# Altium schematic sheet Receiver.SchDoc
size A4; SheetNumber: 1; SheetTotal: 6
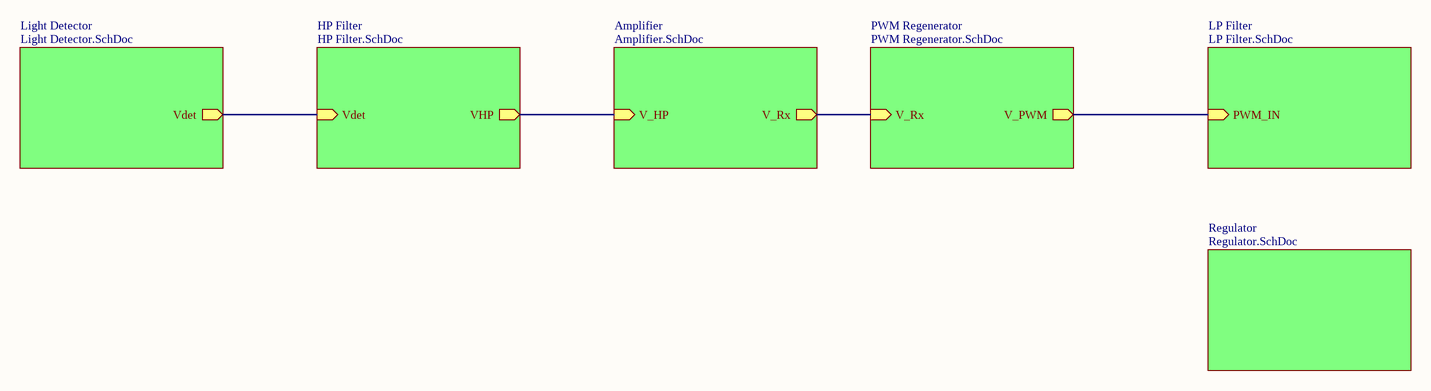
[diagram p0: Receiver.SchDoc]

## Sub-sheets
Amplifier = Amplifier.SchDoc: V_HP (in), V_Rx (out)
HP Filter = HP Filter.SchDoc: VHP (out), Vdet (in)
Light Detector = Light Detector.SchDoc: Vdet (out)
LP Filter = LP Filter.SchDoc: PWM_IN (in)
PWM Regenerator = PWM Regenerator.SchDoc: V_Rx (in), V_PWM (out)
Regulator = Regulator.SchDoc: no entries

## Nets
(unnamed): sheet Light Detector/Vdet, sheet HP Filter/Vdet
(unnamed): sheet HP Filter/VHP, sheet Amplifier/V_HP
(unnamed): sheet Amplifier/V_Rx, sheet PWM Regenerator/V_Rx
(unnamed): sheet PWM Regenerator/V_PWM, sheet LP Filter/PWM_IN